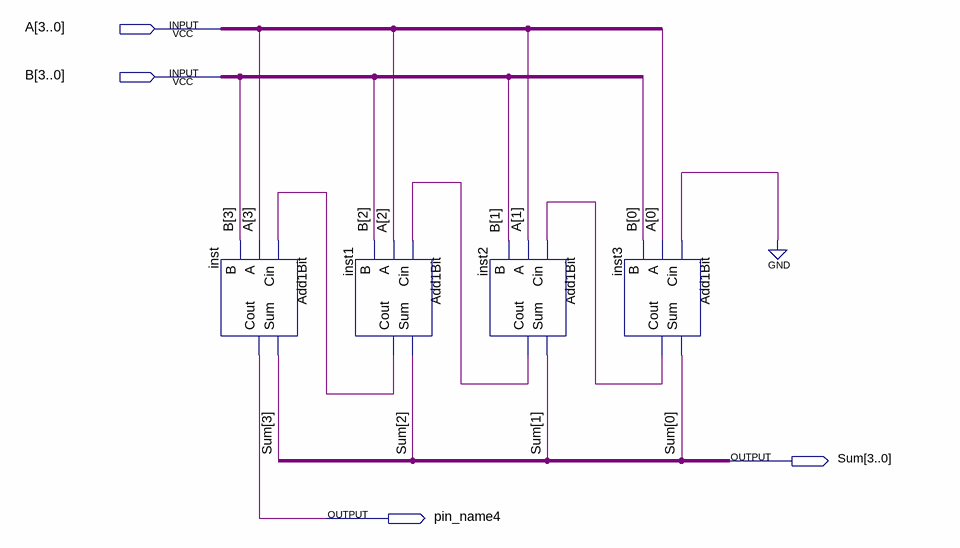
[diagram p0: schematic sheet]
// Quartus schematic Add4bit.bdf as structural Verilog: 4 symbols, 4 pins
module Add4bit (
  input  [3:0] A,
  input  [3:0] B,
  output [3:0] Sum,
  output pin_name4
);

  wire inst1_cout, inst2_cout, inst3_cout;

  Add1Bit inst (.Cin(inst1_cout), .A(A[3]), .B(B[3]), .Sum(Sum[3]), .Cout(pin_name4));
  Add1Bit inst1 (.Cin(inst2_cout), .A(A[2]), .B(B[2]), .Sum(Sum[2]), .Cout(inst1_cout));
  Add1Bit inst2 (.Cin(inst3_cout), .A(A[1]), .B(B[1]), .Sum(Sum[1]), .Cout(inst2_cout));
  Add1Bit inst3 (.Cin(1'b0), .A(A[0]), .B(B[0]), .Sum(Sum[0]), .Cout(inst3_cout));
endmodule
